# Altium schematic sheet Gain.SchDoc
size A; SheetNumber: 4; SheetTotal: 7
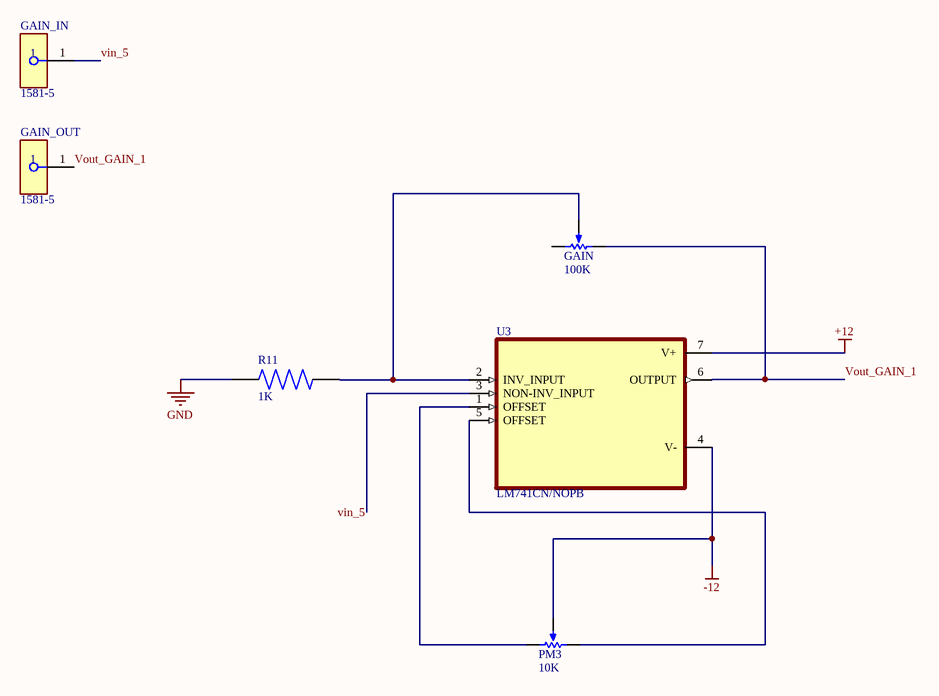
[diagram p0: Gain.SchDoc]

## Parts
GAIN  100K  [PCBComponent_1]
GAIN_IN  1581-5  [FP-1581-5-MFG]
GAIN_OUT  1581-5  [FP-1581-5-MFG]
PM3  10K  [PCBComponent_1]
R11  1K  [RESAD1100W55L680D260]
U3  LM741CN/NOPB  [DIP794W45P254L959H508Q8]

## Nets
+12: U3.7(V+)
-12: PM3.2(S) U3.4(V-)
GND: R11.1
vin_5: GAIN_IN.1 U3.3(NON-INV_INPUT)
Vout_GAIN_1: GAIN.1(CCW) GAIN_OUT.1 U3.6(OUTPUT)
NetGAIN_2: GAIN.2(S) R11.2 U3.2(INV_INPUT)
NetPM3_1: PM3.1(CCW) U3.5(OFFSET)
NetPM3_3: PM3.3(CW) U3.1(OFFSET)

Not connected (* = marked no-connect by the designer): GAIN 3(CW)

## Library data of the parts
GAIN PM3 = Component_1
GAIN_IN GAIN_OUT = CMP-73906-000011-1: CONN BANANA JACK TURRET GREEN; Body Material: PC; Number of Contacts: 1; Max Current Rating: 15A; Voltage Rating (AC): 30V; Insulation: Mating End Insulated; Voltage Rating: 2.5kV; Voltage Rating (DC): 60V; Gender: Female; Height: 0.25inch; Mount: Panel; RoHS Compliant: Yes; Length: 1.22inch; Orientation: Straight; Diameter: 4.22mm; Lead Free: Lead Free; Package Quantity: 1; Termination: Turret; Current Rating: 15A; Packaging: Bag; Series: 1581; REACH SVHC: No SVHC; Number of Positions: 1; Contact Plating: Tin; Housing Color: Green; Contact Material: Brass; Insulation Material: Polycarbonate; Weight: 0.126lb; Number of Ports: 1; Color: Green; Housing Material: Polycarbonate; Width: 4inch
R11 = MFR-25FBF52-1K: 1.07 kOhms Â±1% 0.25W, 1/4W Through Hole Resistor Axial - Metal Film; MF: Yageo; SnapEDA_Link: https://www.snapeda.com/parts/MFR-25FBF52-1K/Yageo/view-part/?ref=snap; Package: RADIAL-2 YAGEO; Value: *; MP: MFR-25FBF52-1K; Check_prices: https://www.snapeda.com/parts/MFR-25FBF52-1K/Yageo/view-part/?ref=eda
U3 = LM741CN/NOPB: Single, 44-V, 1-MHz operational amplifier; MF: Texas Instruments; SnapEDA_Link: https://www.snapeda.com/parts/LM741CN/NOPB/Texas+Instruments/view-part/?ref=snap; Package: PDIP-8 Texas; Value: *; MP: LM741CN/NOPB; Check_prices: https://www.snapeda.com/parts/LM741CN/NOPB/Texas+Instruments/view-part/?ref=eda